# EAGLE design RTI-Dome-Shutter (EAGLE 7.7.0)
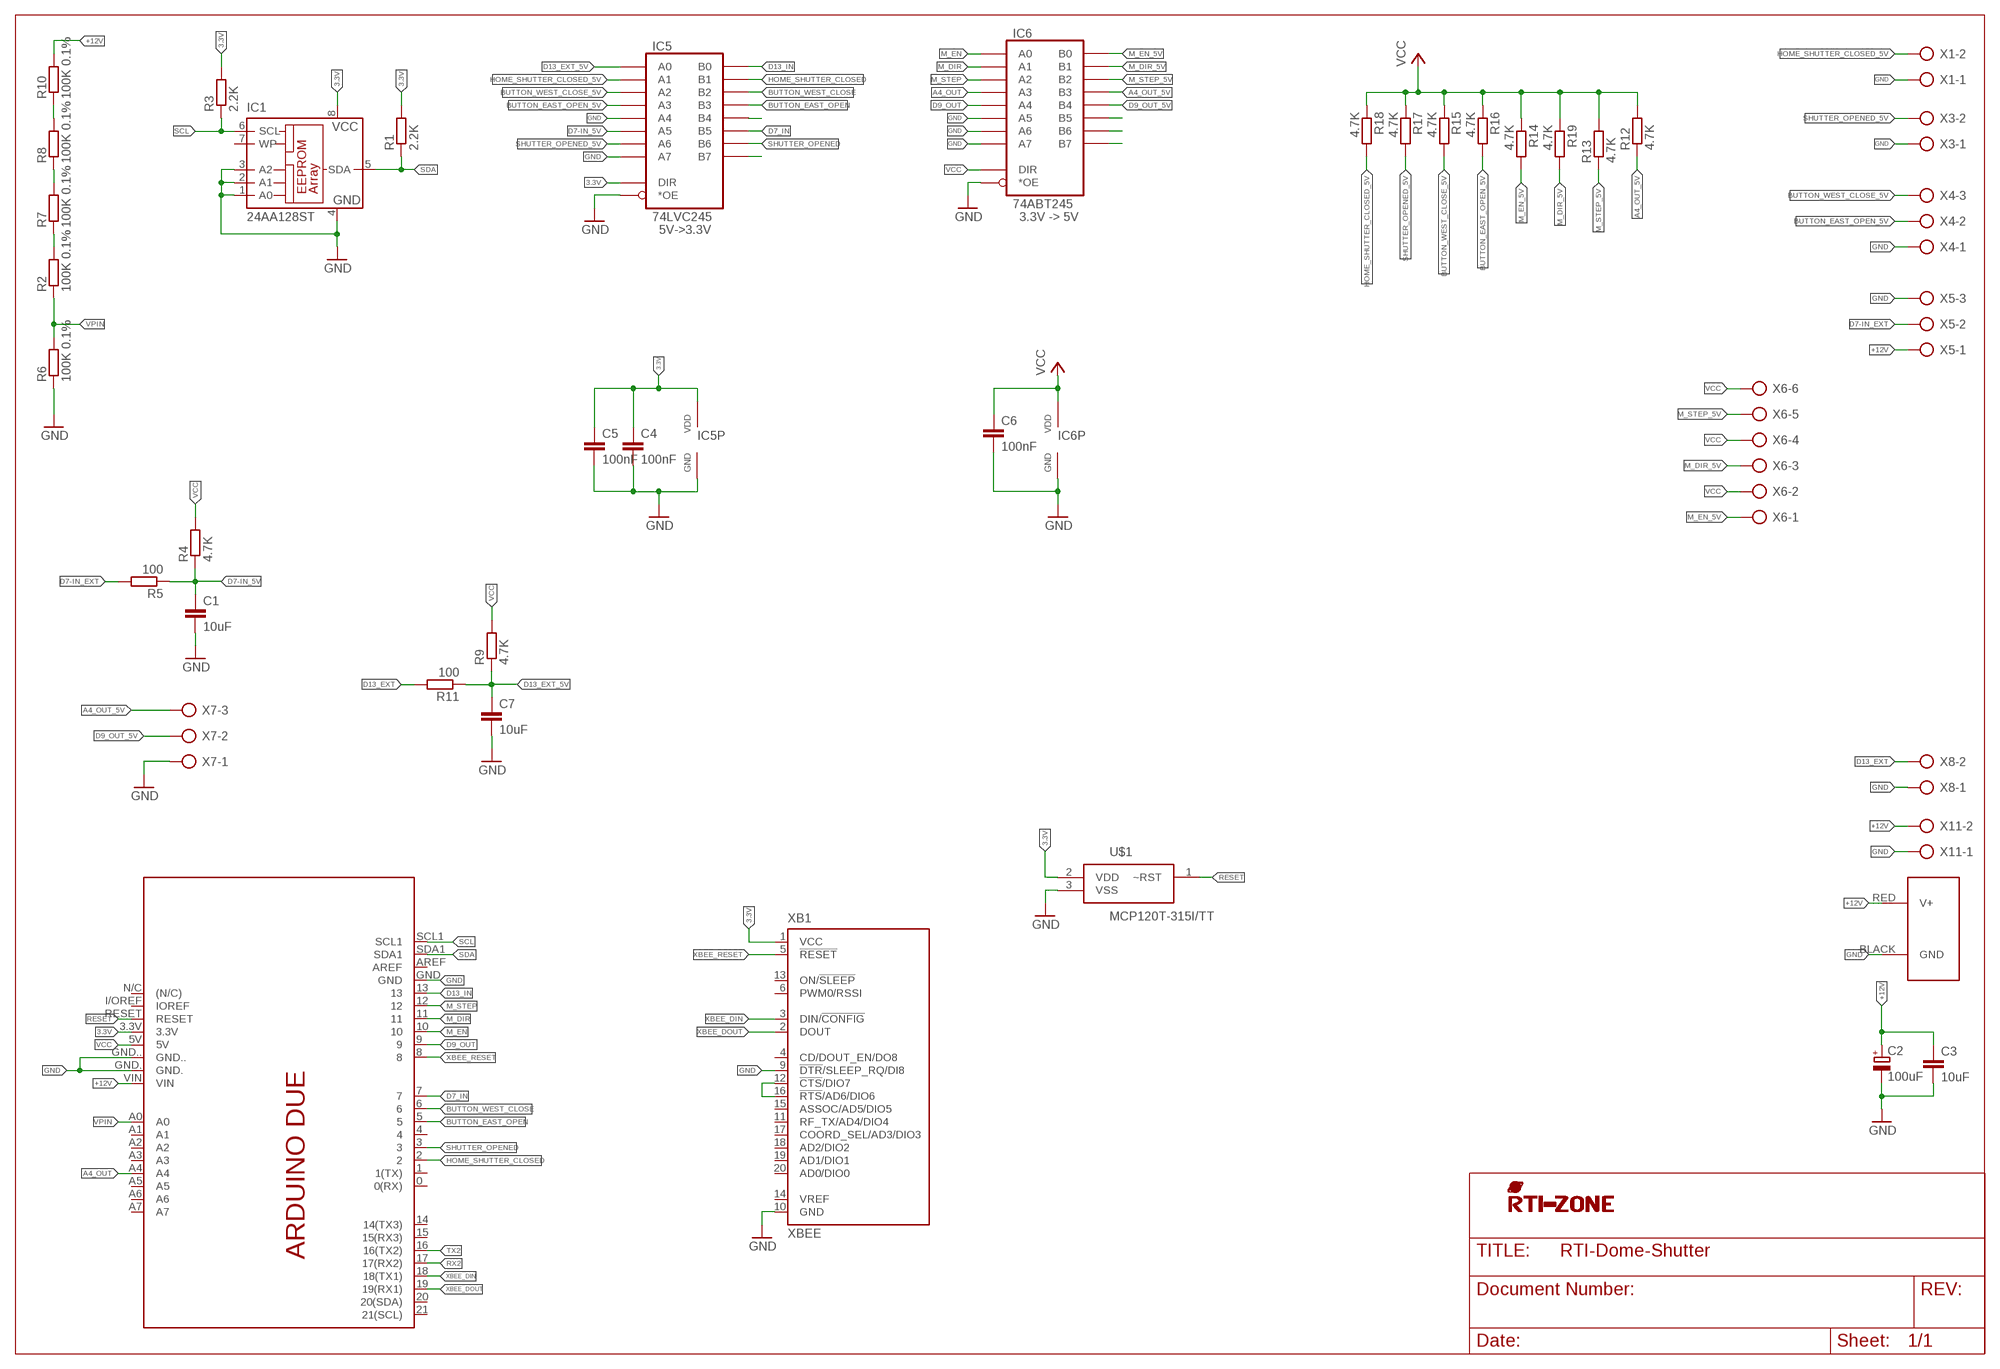
[diagram p0: schematic, sheet 1]

## Parts
C1  10uF  C-EU'0805'  [C0805]
C2  100uF  CPOL-EU  [UD-10X10_NICHICON]
C3  10uF  C-EU'0805'  [C0805]
C4  100nF  C-EU'0805'  [C0805]
C5  100nF  C-EU'0805'  [C0805]
C6  100nF  C-EU'0805'  [C0805]
C7  10uF  C-EU'0805'  [C0805]
IC1  24AA128ST  [TSSOP8]
IC5  74LVC245  [TSSOP20]
IC6  74ABT245  [TSSOP20]
J1  POWERPOLE_POWER45A  [POWERPOLE_PAIR_45A]
PCB1  ARDUINO_DUE_SHIELD_SHORT  [ARDUINO_DUE_SHIELD_SHORT]
R1  2.2K  R-EU'0805'  [R0805]
R2  100K 0.1%  R-EU'0805'  [R0805]
R3  2.2K  R-EU'0805'  [R0805]
R4  4.7K  R-EU'0805'  [R0805]
R5  100  R-EU'0805'  [R0805]
R6  100K 0.1%  R-EU'0805'  [R0805]
R7  100K 0.1%  R-EU'0805'  [R0805]
R8  100K 0.1%  R-EU'0805'  [R0805]
R9  4.7K  R-EU'0805'  [R0805]
R10  100K 0.1%  R-EU'0805'  [R0805]
R11  100  R-EU'0805'  [R0805]
R12  4.7K  R-EU'0805'  [R0805]
R13  4.7K  R-EU'0805'  [R0805]
R14  4.7K  R-EU'0805'  [R0805]
R15  4.7K  R-EU'0805'  [R0805]
R16  4.7K  R-EU'0805'  [R0805]
R17  4.7K  R-EU'0805'  [R0805]
R18  4.7K  R-EU'0805'  [R0805]
R19  4.7K  R-EU'0805'  [R0805]
U$1  MCP120T-315I/TT  MCP120T  [SOT95P237X112-3N]
U$4  RTI-LOGO_BIG  [LOGO_BIG]
X1  AK500/2  [AK500/2]
X3  AK500/2  [AK500/2]
X4  AK500/3  [AK500/3]
X5  AK500/3  [AK500/3]
X6  AK500/6  [AK500/6]
X7  AK500/3  [AK500/3]
X8  AK500/2  [AK500/2]
X11  AK500/2  [AK500/2]
XB1  XBEE  [XBEE]

## Nets
3.3V: C4.1 C5.1 IC1.8(VCC) IC5.P$1(DIR) IC5.P$20(VDD) PCB1.3.3V R1.2 R3.2 U$1.2(VDD) XB1.1(VCC)
+12V [+12V]: C2.+ C3.1 J1.RED(V+) PCB1.VIN R10.2 X5.1 X11.2
A4_OUT: IC6.P$5(A3) PCB1.A4
A4_OUT_5V: IC6.P$15(B3) R12.1 X7.3
BUTTON_EAST_OPEN: IC5.P$15(B3) PCB1.5
BUTTON_EAST_OPEN_5V: IC5.P$5(A3) R16.2 X4.2
BUTTON_WEST_CLOSE: IC5.P$16(B2) PCB1.6
BUTTON_WEST_CLOSE_5V: IC5.P$4(A2) R15.2 X4.3
D7-IN_5V: C1.1 IC5.P$7(A5) R4.1 R5.1
D7-IN_EXT: R5.2 X5.2
D7_IN: IC5.P$13(B5) PCB1.7
D9_OUT: IC6.P$6(A4) PCB1.9
D9_OUT_5V: IC6.P$14(B4) X7.2
D13_EXT: R11.2 X8.2
D13_EXT_5V: C7.1 IC5.P$2(A0) R9.1 R11.1
D13_IN: IC5.P$18(B0) PCB1.13
GND [GND]: C1.2 C2.- C3.2 C4.2 C5.2 C6.2 C7.2 IC1.1(A0) IC1.2(A1) IC1.3(A2) IC1.4(GND) IC5.P$6(A4) IC5.P$9(A7) IC5.P$10(GND) IC5.P$19(*OE) IC6.P$7(A5) IC6.P$8(A6) IC6.P$9(A7) IC6.P$10(GND) IC6.P$19(*OE) J1.BLACK(GND) PCB1.GND PCB1.GND. PCB1.GND.. R6.1 U$1.3(VSS) X1.1 X3.1 X4.1 X5.3 X7.1 X8.1 X11.1 XB1.9(!DTR!/SLEEP_RQ/DI8) XB1.10(GND)
HOME_SHUTTER_CLOSED: IC5.P$17(B1) PCB1.2
HOME_SHUTTER_CLOSED_5V: IC5.P$3(A1) R18.2 X1.2
M_DIR: IC6.P$3(A1) PCB1.11
M_DIR_5V: IC6.P$17(B1) R19.2 X6.3
M_EN: IC6.P$2(A0) PCB1.10
M_EN_5V: IC6.P$18(B0) R14.2 X6.1
M_STEP: IC6.P$4(A2) PCB1.12
M_STEP_5V: IC6.P$16(B2) R13.1 X6.5
N$1: IC5.P$11(B7)
N$2: R7.2 R8.1
N$3: R8.2 R10.1
N$4: IC5.P$14(B4)
N$5: R2.2 R7.1
N$6: IC6.P$13(B5)
N$7: IC6.P$12(B6)
N$8: IC6.P$11(B7)
N$9: XB1.12(!CTS!/DIO7) XB1.16(!RTS!/AD6/DIO6)
RESET: PCB1.RESET U$1.1(~RST)
RX2: PCB1.17(17(RX2))
SCL: IC1.6(SCL) PCB1.SCL1 R3.1
SDA: IC1.5(SDA) PCB1.SDA1 R1.1
SHUTTER_OPENED: IC5.P$12(B6) PCB1.3
SHUTTER_OPENED_5V: IC5.P$8(A6) R17.2 X3.2
TX2: PCB1.16(16(TX2))
VCC: C6.1 IC6.P$1(DIR) IC6.P$20(VDD) PCB1.5V R4.2 R9.2 R12.2 R13.2 R14.1 R15.1 R16.1 R17.1 R18.1 R19.1 X6.2 X6.4 X6.6
VPIN: PCB1.A0 R2.1 R6.2
XBEE_DIN: PCB1.18(18(TX1)) XB1.3(DIN/!CONFIG)
XBEE_DOUT: PCB1.19(19(RX1)) XB1.2(DOUT)
XBEE_RESET: PCB1.8 XB1.5(!RESET)
Unconnected: IC1.7(WP) PCB1.0(0(RX)) PCB1.1(1(TX)) PCB1.4 PCB1.14(14(TX3)) PCB1.15(15(RX3)) PCB1.20(20(SDA)) PCB1.21(21(SCL)) PCB1.A1 PCB1.A2 PCB1.A3 PCB1.A5 PCB1.A6 PCB1.A7 PCB1.AREF PCB1.I/OREF(IOREF) PCB1.N/C((N/C)) XB1.4(CD/DOUT_EN/DO8) XB1.6(PWM0/RSSI) XB1.11(RF_TX/AD4/DIO4) XB1.13(ON/!SLEEP) XB1.14(VREF) XB1.15(ASSOC/AD5/DIO5) XB1.17(COORD_SEL/AD3/DIO3) XB1.18(AD2/DIO2) XB1.19(AD1/DIO1) XB1.20(AD0/DIO0)

## Notes on the sheet
- 3.3V -> 5V
- 5V->3.3V

## Library data of the parts
C1 C3-C7 = rti:C-EU
C2 = rti:CPOL-EU
IC1 = microchip:24*: Serial EEPROM I2C; MF: MICROCHIP; MPN: 24AA128-I/ST; OC_FARNELL: unknown; OC_NEWARK: 92C6843
IC5 IC6 = rti:74*245
J1 = powerpoles:POWERPOLE_POWER: Anderson Powerpole Power Connector using ameteur radio standard layout
PCB1 = arduino_shield:ARDUINO_DUE_SHIELD_SHORT: Device for representing an Arduino Due board with a footprint in an EAGLE design. Created by Dave Young for Element14. More EAGLE documentation at: http://www.element14.com/community/community/knode/cadsoft_eagle
R1-R19 = rti:R-EU
U$1 = MCP120T:MCP120T: Microcontroller Supervisory Circuit Source: Datasheet; DESCRIPTION: Microcontroller Supervisory Circuit; HEIGHT: mm; MANUFACTURER_NAME: Microchip; MANUFACTURER_PART_NUMBER: MCP120T-315I/TT; MOUSER_PART_NUMBER: 579-MCP120T-315I/TT; MOUSER_PRICE-STOCK: https://www.mouser.com/ProductDetail/Microchip-Technology/MCP120T-315I-TT/?qs=6pREnGtJ7gEI3DoW5cf%2FYQ%3D%3D; MPN: MCP120T-315I/TT
U$4 = rti:RTI-LOGO
X1 X3 X8 X11 = con-ptr500:AK500/2: CONNECTOR; OC_FARNELL: unknown; OC_NEWARK: unknown
X4 X5 X7 = con-ptr500:AK500/3: CONNECTOR; OC_FARNELL: unknown; OC_NEWARK: unknown
X6 = con-ptr500:AK500/6: CONNECTOR; OC_FARNELL: unknown; OC_NEWARK: unknown
XB1 = maxstream:XBEE: XBee (TM) /XBee-PRO(TM) OEM RF Modules Source: MaxStream, Inc. xbee_productmanual.pdf; MPN: XBP24-Z7UIT-004; OC_FARNELL: 1751799; OC_NEWARK: 34R5507

## Net classes
0 default: width 0.254 mm, drill 0.3 mm, clearance 0.203 mm
1 +12V: width 0.254 mm, drill 0.3 mm, clearance 0.203 mm
2 GND: width 0.254 mm, drill 0.3 mm, clearance 0.203 mm

## Board
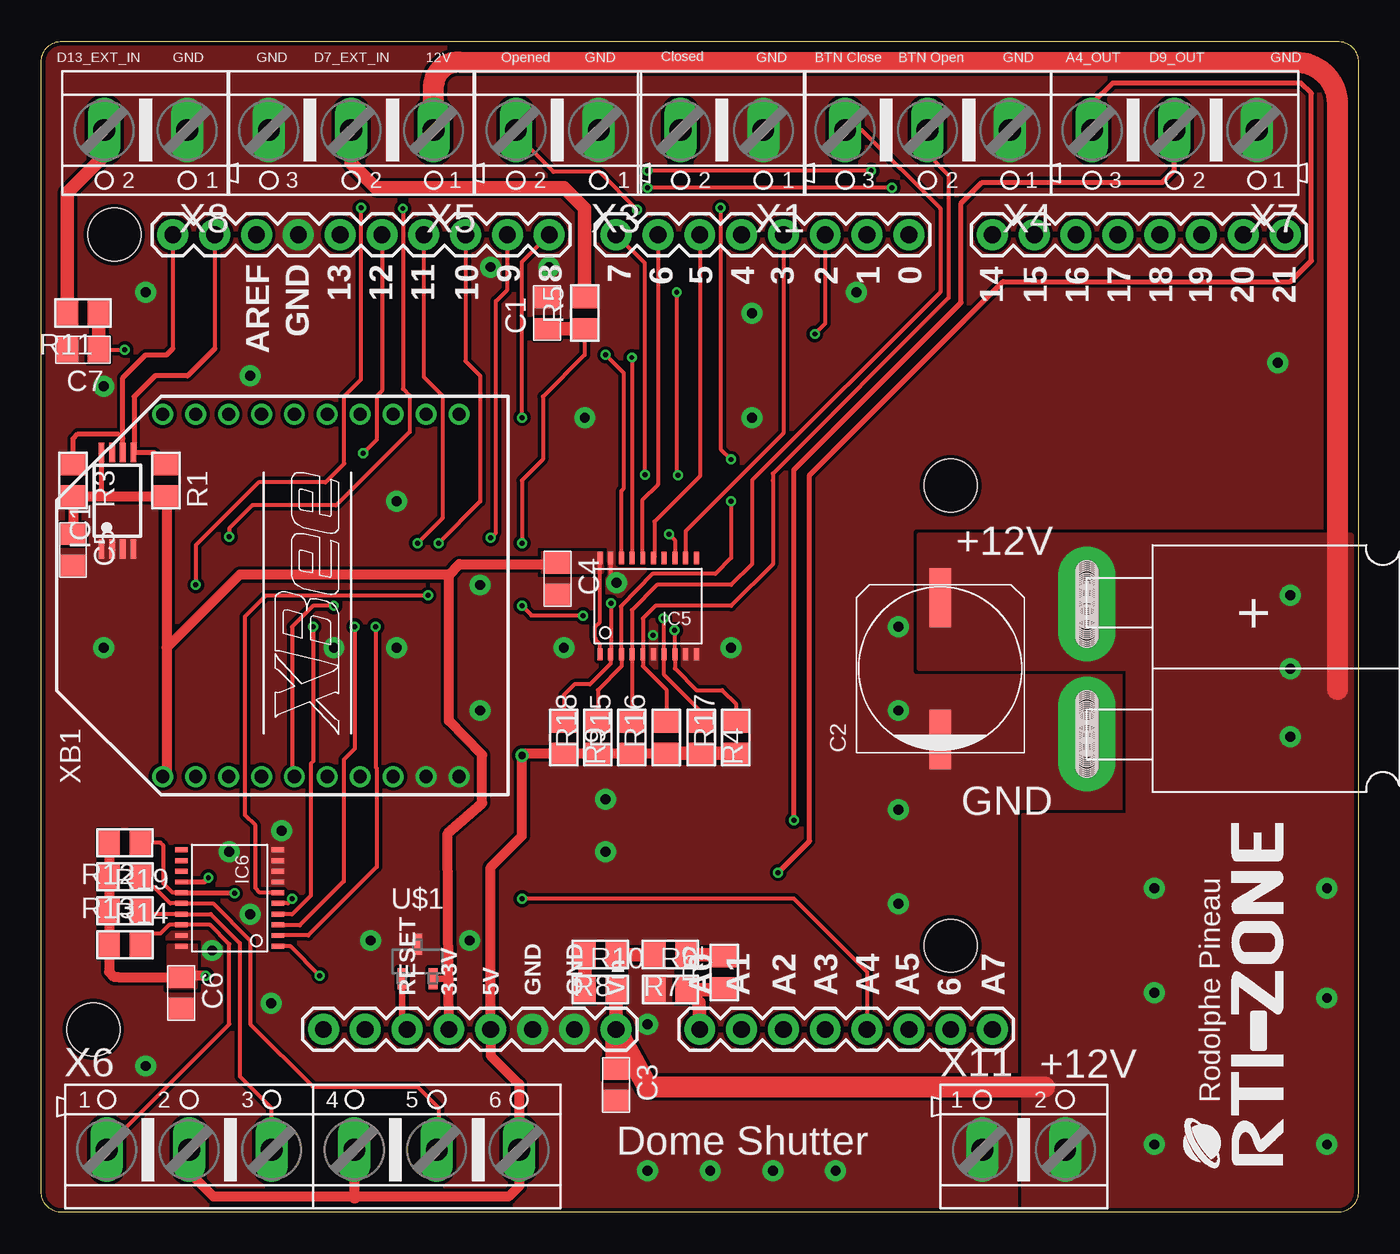
[diagram p1: board, top side]
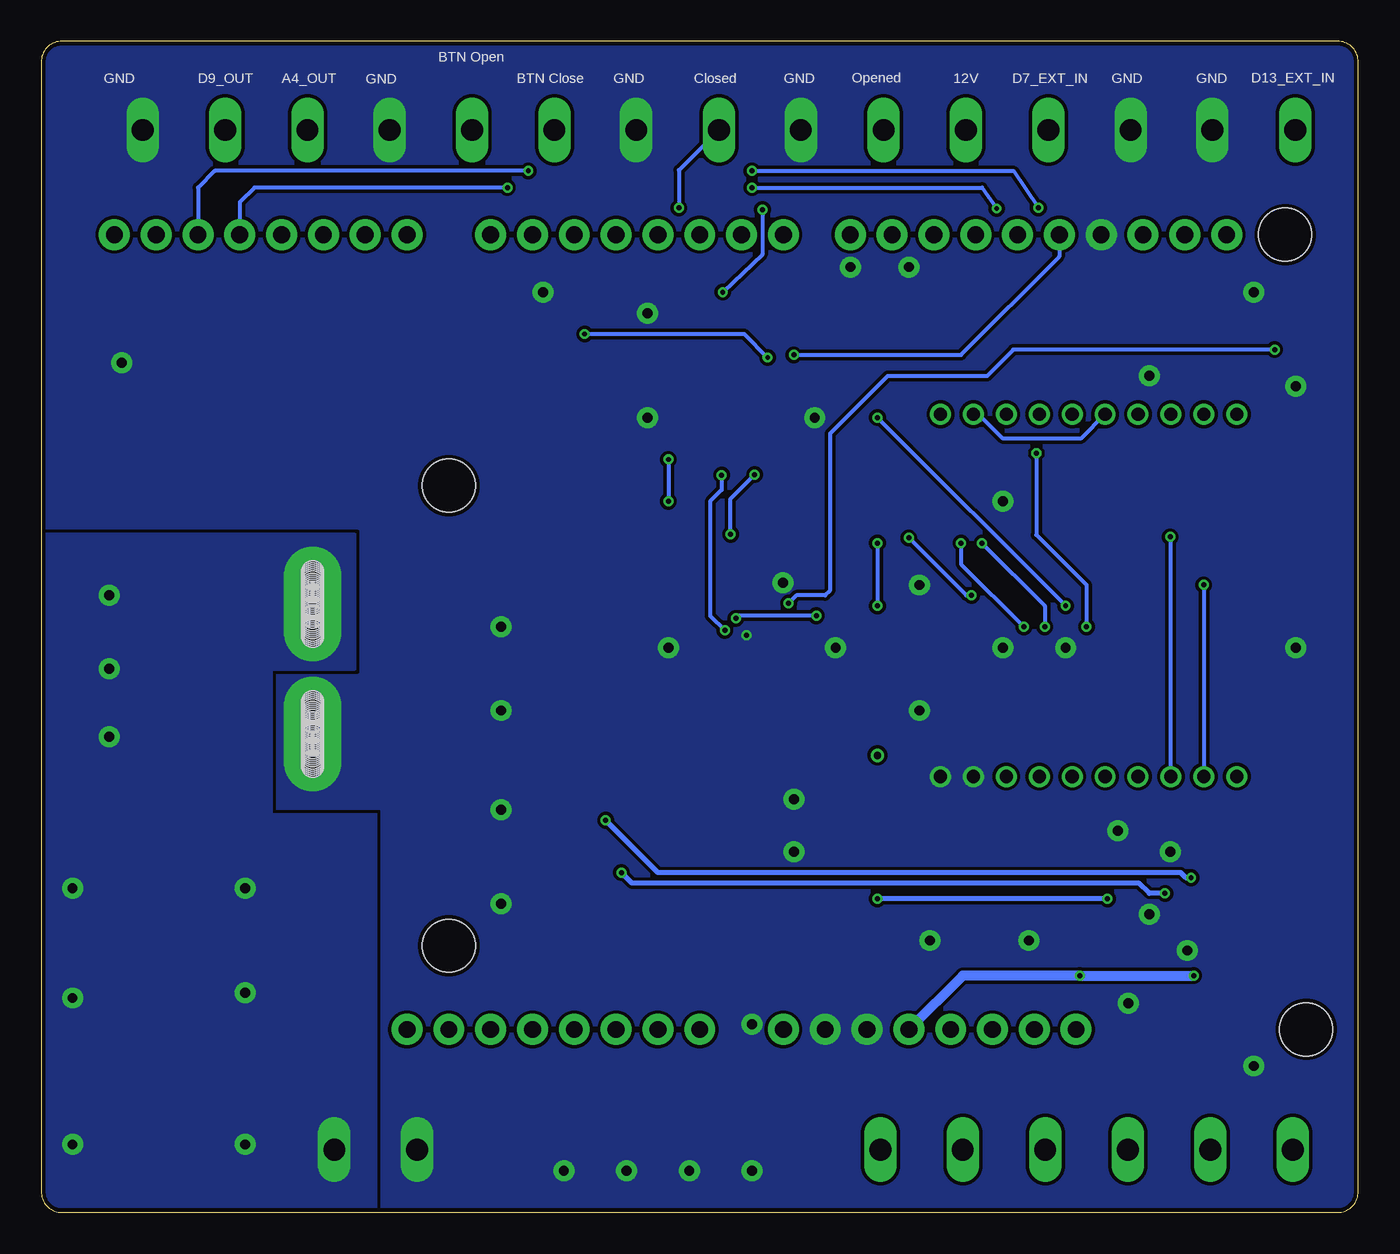
[diagram p2: board, bottom side, seen from below]

Size 80.01 x 71.12 mm. Coordinates in mm from the lower left corner, seen from the top.
Outline: 0,1.27 0,69.85 arc-90 1.27,71.12 78.74,71.12 arc-90 80.01,69.85 80.01,1.27 arc-90 78.74,0 1.27,0 arc-90 0,1.27
Copper layers (1*16): Top 0.35mm / dielectric 1.6mm / Bottom 0.35mm
Design rules "jlcpcb2layer": minimum track width 5mil, minimum drill 0.2mm, track to track 5mil, track to pad 5mil, pad to pad 5mil, via to via 5mil, smd to smd 5mil, copper to edge 10mil, drill to drill 0.5mm, minimum pad ring 6mil, minimum via ring 6mil, stop-mask expansion 0.05mm, vias tented up to drill 130mil, thermal gap 8mil

### Footprints (pad centres in the part's own frame; a part is rotated, then mirrored left to right if it is on the bottom)
C0805 = smd 1.3 x 1.5: 1 -0.95,0; 2 0.95,0
UD-10X10_NICHICON = smd 3.6 x 1.3: + 4.3,0; - -4.3,0
TSSOP8 = smd 0.35 x 1.2: 1 -0.975,-2.925; 2 -0.325,-2.925; 3 0.325,-2.925; 4 0.975,-2.925; 5 0.975,2.925; 6 0.325,2.925; 7 -0.325,2.925; 8 -0.975,2.925
TSSOP20 = smd 0.75 x 0.3: P$1 -2.94,2.885; P$2 -2.94,2.235; P$3 -2.94,1.585; P$4 -2.94,0.935; P$5 -2.94,0.285; P$6 -2.94,-0.365; P$7 -2.94,-1.015; P$8 -2.94,-1.665; P$9 -2.94,-2.315; P$10 -2.94,-2.965; P$11 2.91,-2.965; P$12 2.91,-2.315; P$13 2.91,-1.665; P$14 2.91,-1.015; P$15 2.91,-0.365; P$16 2.91,0.285; P$17 2.91,0.935; P$18 2.91,1.585; P$19 2.91,2.235; P$20 2.91,2.885
POWERPOLE_PAIR_45A = drill 1.27 pad 3.5 long: BLACK 3.97,0.02; RED -3.93,0.02 | hole 1.27: -1.95,0.02; -5.91,0.02; 1.99,0.02; 5.95,0.02; -4.64,0.02; -3.37,0.02; 3.26,0.02; 4.68,0.02; -5.656,0.02; -5.783,0.02; -5.529,0.02; -5.402,0.02; -5.275,0.02; -5.148,0.02; -5.021,0.02; -4.894,0.02; -4.767,0.02; -2.077,0.02; -2.204,0.02; -2.331,0.02; -2.458,0.02; -2.585,0.02; -2.712,0.02; -2.966,0.02; -2.839,0.02; -3.093,0.02; -3.22,0.02; -3.497,0.02; -3.624,0.02; -3.751,0.02; -3.878,0.02; -4.005,0.02; -4.132,0.02; -4.259,0.02; -4.386,0.02; -4.513,0.02; 5.823,0.02; 5.696,0.02; 5.569,0.02; 5.442,0.02; 5.315,0.02; 5.188,0.02; 5.061,0.02; 4.934,0.02; 4.807,0.02; 4.553,0.02; 4.426,0.02; 4.299,0.02; 4.045,0.02; 4.045,0.02; 4.172,0.02; 3.918,0.02; 3.791,0.02; 3.791,0.02; 3.664,0.02; 3.664,0.02; 3.664,0.02; 3.537,0.02; 3.537,0.02; 3.41,0.02; 3.133,0.02; 3.006,0.02; 2.879,0.02; 2.752,0.02; 2.625,0.02; 2.498,0.02; 2.371,0.02; 2.244,0.02; 2.117,0.02
ARDUINO_DUE_SHIELD_SHORT = drill 1.016 pad 1.88: 0 12.7,26.67; 1 10.16,26.67; 2 7.62,26.67; 3 5.08,26.67; 3.3V -15.24,-21.59; 4 2.54,26.67; 5 0,26.67; 5V -12.7,-21.59; 6 -2.54,26.67; 7 -5.08,26.67; 8 -9.144,26.67; 9 -11.684,26.67; 10 -14.224,26.67; 11 -16.764,26.67; 12 -19.304,26.67; 13 -21.844,26.67; 14 17.78,26.67; 15 20.32,26.67; 16 22.86,26.67; 17 25.4,26.67; 18 27.94,26.67; 19 30.48,26.67; 20 33.02,26.67; 21 35.56,26.67; A0 0,-21.59; A1 2.54,-21.59; A2 5.08,-21.59; A3 7.62,-21.59; A4 10.16,-21.59; A5 12.7,-21.59; A6 15.24,-21.59; A7 17.78,-21.59; AREF -26.924,26.67; GND -24.384,26.67; GND. -7.62,-21.59; GND.. -10.16,-21.59; I/OREF -20.32,-21.59; N/C -22.86,-21.59; RESET -17.78,-21.59; SCL1 -32.004,26.67; SDA1 -29.464,26.67; VIN -5.08,-21.59 | hole 3.2: -35.56,26.67; -36.83,-21.59; 15.24,11.43; 15.24,-16.51
R0805 = smd 1.3 x 1.5: 1 -0.95,0; 2 0.95,0
SOT95P237X112-3N = smd 0.559 x 1.27: 1 -0.94,-1.041; 2 0.94,-1.041; 3 0,1.041
AK500/2 = drill 1.321 long: 1 -2.515,0; 2 2.515,0
AK500/3 = drill 1.321 long: 1 -5.004,0; 2 0,0; 3 5.004,0
AK500/6 = drill 1.321 long: 1 -12.522,0; 2 -7.518,0; 3 -2.515,0; 4 2.515,0; 5 7.518,0; 6 12.522,0
XBEE = drill 0.8 pad 1.27: 1 -11,9; 2 -11,7; 3 -11,5; 4 -11,3; 5 -11,1; 6 -11,-1; 7 -11,-3; 8 -11,-5; 9 -11,-7; 10 -11,-9; 11 11,-9; 12 11,-7; 13 11,-5; 14 11,-3; 15 11,-1; 16 11,1; 17 11,3; 18 11,5; 19 11,7; 20 11,9

### Placement (x,y rotation side)
C1  30.73,54.61 90 top
C2  54.61,33.02 90 top
C3  34.92,7.75 270 top
C4  31.37,38.48 270 top
C5  1.94,40.23 270 top
C6  8.51,13.34 270 top
C7  2.54,52.39 180 top
IC1  4.64,43.21 0 top
IC5  36.83,36.83 90 top
IC6  11.43,19.05 180 top
J1  63.5,33.02 270 top
PCB1  40.01,32.7 0 top
R1  7.59,44.45 270 top
R2  41.5,14.57 90 top
R3  1.94,44.45 270 top
R4  40.1,28.83 270 top
R5  33.02,54.61 90 top
R6  38.23,13.53 0 top
R7  38.23,15.65 180 top
R8  33.97,15.65 180 top
R9  31.75,28.83 270 top
R10  33.97,13.53 0 top
R11  2.54,54.61 180 top
R12  5.08,22.45 180 top
R13  5.08,20.38 180 top
R14  5.08,16.26 0 top
R15  35.88,28.83 90 top
R16  37.97,28.83 90 top
R17  42.2,28.83 90 top
R18  33.81,28.83 90 top
R19  5.08,18.32 0 top
U$1  22.86,15.24 0 top
U$4  75.44,2.86 90 top
X1  41.35,65.72 180 top
X3  31.35,65.72 180 top
X4  53.84,65.72 180 top
X5  18.83,65.72 180 top
X6  16.51,3.81 0 top
X7  68.84,65.72 180 top
X8  6.35,65.72 180 top
X11  59.69,3.81 0 top
XB1  16.38,37.47 90 top

### Tracks (layer width: path | path; a pad name or v marks a point on that pad's centre or on a via)
3.3V
  Top 0.254: IC5.P$1 33.94,34.51 33.69,34.77 33.69,34.86 33.66,34.89 33.66,35.56 33.95,35.85 IC5.P$20
  Top 0.305: IC1.8 3.66,43.65 3.81,43.5
  Top 0.406: 31.43,39.49 C4.1 | U$1.2 24.52,14.2 24.75,13.97
  Top 0.61: 24.77,38.73 25.4,39.37 31.31,39.37 | 24.77,38.73 12.06,38.73 7.62,34.29 | 7.62,34.29 7.62,26.7 XB1.1 | PCB1.3.3V 24.75,13.97 24.7,23.02 26.8,24.86 26.8,27.78 24.77,29.84 24.77,38.73 | 7.62,34.29 7.62,43.47 arc90 R1.2 3.81,43.5 R3.2 C5.1
  Top 0.813: 31.31,39.37 C4.1
  pour Top (isolate 0.254, no thermals): 30.48,40.07 34.07,40.07 34.07,38.86 30.48,38.86
+12V  (via drill 0.6 pad 1.27)
  Top 0.813: R10.2 PCB1.VIN
  Top 1.27: 78.74,31.75 78.74,67.31 arc90 76.2,69.85 25.4,69.85 arc90 23.83,68.41 X5.1 | 60.96,7.62 36.83,7.62 PCB1.VIN C3.1
  Top 2.54: 63.52,37.32 J1.RED
  other vias: 75.88,37.47 75.88,33.02 75.88,28.89 78.11,19.68 78.11,13.02 78.11,4.13 67.63,19.68 67.63,13.34 67.63,4.13
  pour Top (no thermals): 53.34,41.15 79.57,41.15 79.88,0 59.69,0 59.69,24.13 66.04,24.13 66.04,33.02 53.34,33.02
  pour Bottom (no thermals): 60.96,41.15 79.88,41.15 79.88,0 59.69,0 59.69,24.13 66.04,24.13 66.04,33.02 60.96,33.02
A4_OUT  (via drill 0.3 pad 0.25)
  Top 0.254: v29.21,19.05 45.72,19.05 50.16,14.61 PCB1.A4 | v15.24,19.05 15.24,19.02 14.99,18.76 IC6.P$5
  Bottom 0.305: v15.24,19.05 v29.21,19.05
A4_OUT_5V  (via drill 0.3)
  Top 0.254: IC6.P$15 7.99,19.41 7.43,19.97 7.43,22.26 7.24,22.45 R12.1
  Top 0.305: IC6.P$15 11.7,19.41 v11.75,19.37 | v44.77,20.64 46.67,22.54 46.67,44.77 58.42,56.52 75.88,56.52 77.15,57.78 77.15,67.94 76.52,68.58 65.09,68.58 63.82,67.31 63.82,66.67 63.84,66.66 X7.3
  Bottom 0.305: v11.75,19.37 12.7,19.37 13.34,20 44.13,20 v44.77,20.64
BUTTON_EAST_OPEN
  Top 0.254: PCB1.5 40.01,44.7 37.24,41.94 37.24,39.79 IC5.P$15
BUTTON_EAST_OPEN_5V
  Top 0.254: R16.2 37.97,31.75 36.55,33.18 IC5.P$5 36.54,36.07 37.31,36.83 41.91,36.83 44.45,39.37 44.45,44.45 44.45,44.86 55.12,55.53 55.12,62.99 53.84,64.27 X4.2
BUTTON_WEST_CLOSE
  Top 0.254: PCB1.6 37.47,44.2 36.51,43.24 36.51,39.77 IC5.P$16
BUTTON_WEST_CLOSE_5V
  Top 0.254: R15.2 35.9,29.8 IC5.P$4 35.88,33.91 35.88,36.58 37.4,38.1 41.91,38.1 43.18,39.37 43.18,44.45 54.61,55.88 54.61,60.96 49.85,65.72 X4.3
D7-IN_5V  (via drill 0.3 pad 0.25)
  Top 0.254: R4.1 40.1,30.39 37.84,32.64 IC5.P$7 37.81,33.92 v37.81,36.07 | R5.1 33.02,52.07 30.48,49.53 30.48,45.72 29.21,44.45 v29.21,40.64 | v29.21,36.83 29.78,36.26 32.89,36.26 v32.92,36.23
  Top 0.813: C1.1 R5.1
  Bottom 0.254: v29.21,40.64 v29.21,36.83 | v32.92,36.23 37.66,36.23 v37.81,36.07
D7-IN_EXT
  Top 0.813: R5.2 33.02,60.96 31.75,62.23 20.32,62.23 18.83,63.72 X5.2
D7_IN  (via drill 0.3 pad 0.25)
  Top 0.254: v36.67,44.8 36.67,57.63 PCB1.7 | v38.13,41.18 38.49,40.82 IC5.P$13
  Bottom 0.254: v38.13,41.18 38.13,43.34 v36.67,44.8
D9_OUT  (via drill 0.3)
  Top 0.254: IC6.P$6 13.29,19.41 13.02,19.68 13.02,23.5 12.38,24.13 12.38,36.2 13.65,37.47 v23.5,37.47 | v27.3,40.96 27.62,41.27 27.62,42.55 27.62,55.34 28.32,56.04 PCB1.9
  Bottom 0.254: v23.5,37.47 23.81,37.47 v27.3,40.96
D9_OUT_5V  (via drill 0.3)
  Top 0.305: v45.72,23.81 45.72,45.09 55.88,55.24 55.88,61.28 57.15,62.55 68.1,62.55 68.83,63.28 X7.2 | IC6.P$14 9.9,20.07 v10.16,20.32
  Bottom 0.305: v10.16,20.32 10.48,20.32 10.79,20.64 42.55,20.64 v45.72,23.81
D13_EXT
  Top 0.813: X8.2 3.83,64.16 1.59,61.91 R11.2
D13_EXT_5V  (via drill 0.3)
  Top 0.254: R9.1 31.75,31.43 32.38,32.07 33.34,32.07 34.59,33.33 IC5.P$2 34.61,33.9 v34.61,36.99 | C7.1 3.81,52.38 v5.08,52.39
  Top 0.813: R11.1 C7.1
  Bottom 0.254: v5.08,52.39 20.95,52.39 22.54,50.8 28.57,50.8 32.07,47.31 32.07,37.78 32.38,37.47 34.13,37.47 v34.61,36.99
D13_IN  (via drill 0.3 pad 0.25)
  Top 0.254: v34.29,52.07 35.4,50.96 35.4,43.97 35.24,43.82 IC5.P$18
  Bottom 0.254: PCB1.13 18.16,58.04 24.13,52.07 v34.29,52.07
GND  (via drill 0.3 pad 0.25, 0.6 pad 1.27)
  Top 0.254: IC5.P$19 34.59,38.59 v34.96,38.23
  other vias: 41.91,34.29 26.67,38.1 43.18,48.26 34.29,25.08 26.67,30.48 33.02,48.26 30.86,57.4 27.3,57.4 21.59,43.18 17.78,34.29 75.12,51.59 12.7,50.8 11.43,21.91 52.07,24.45 52.07,18.73 34.29,21.91 52.07,30.48 43.18,54.61 52.07,35.56 49.53,55.88 21.59,34.29 3.81,34.29 31.75,34.29 14.61,23.18 13.97,12.7 26.04,16.51 6.35,8.89 10.38,15.91 36.83,2.54 40.64,2.54 44.45,2.54 48.26,2.54 3.81,50.16 6.35,55.88 36.83,11.43 37.18,35.05 20,16.51 12.7,18.1
  pour Bottom (rank 2, no thermals): 0,0 0,71.12 80.01,71.12 80.01,0
  pour Top (rank 2, no thermals): 0,0 0,71.12 80.01,71.12 80.01,0
HOME_SHUTTER_CLOSED  (via drill 0.3 pad 0.25)
  Top 0.254: PCB1.2 47.62,53.98 v46.99,53.34 | 35.88,39.76 IC5.P$17 35.88,39.76 | v35.88,51.91 35.88,39.76
  Bottom 0.254: v46.99,53.34 37.31,53.34 v35.88,51.91
HOME_SHUTTER_CLOSED_5V  (via drill 0.3 pad 0.25)
  Top 0.254: R18.2 33.81,31.72 35.24,33.15 IC5.P$3 35.21,33.92 35.21,36.8 37.15,38.77 40.96,38.77 41.91,39.75 v41.91,43.18 | v41.27,60.99 41.27,46.35 v41.91,45.72
  Bottom 0.254: v41.91,45.72 v41.91,43.18 | X1.2 41.27,63.28 v41.27,60.99
M_DIR  (via drill 0.3 pad 0.25)
  Top 0.254: PCB1.11 23.24,50.74 24.38,49.59 24.38,42.16 v22.86,40.64 | v19.05,35.56 19.05,28.16 18.38,27.5 18.38,20.1 15.72,17.43 14.4,17.43 IC6.P$3
  Bottom 0.254: v22.86,40.64 19.05,36.83 v19.05,35.56
M_DIR_5V
  Top 0.254: R19.2 6.24,18.11 IC6.P$17 10.3,18.11 12.06,16.35 12.06,8.26 13.97,6.35 13.97,3.83 X6.3
M_EN  (via drill 0.3 pad 0.25)
  Top 0.254: PCB1.10 25.78,51.69 26.67,50.8 26.67,43.18 v24.13,40.64 | v20.32,35.56 20.32,27.02 20.38,26.96 20.38,20.99 16.22,16.83 14.38,16.83 IC6.P$2
  Bottom 0.254: v24.13,40.64 24.13,39.37 v20.32,35.56
M_EN_5V
  Top 0.254: R14.2 6.7,16.92 7.24,16.92 7.78,17.46 IC6.P$18 10.26,17.46 11.43,16.29 11.43,11.43 3.99,3.99 X6.1
M_STEP  (via drill 0.3 pad 0.25)
  Top 0.254: PCB1.12 20.7,49.88 20.38,49.56 20.38,46.93 v19.56,46.1 | v16.51,35.56 16.51,27.37 16.38,27.24 16.38,19.24 15.24,18.1 14.39,18.1 IC6.P$4
  Bottom 0.254: v19.56,46.1 19.56,41.15 16.51,38.1 v16.51,35.56
M_STEP_5V
  Top 0.254: R13.1 6.67,19.75 6.86,19.75 7.84,18.77 IC6.P$16 10.45,18.77 12.7,16.51 12.7,11.43 16.51,7.62 22.86,7.62 24.13,6.35 24.13,3.91 X6.5
N$2
  Top 0.813: R8.1 R7.2
N$3
  Top 0.813: R8.2 R10.1
N$5
  Top 0.813: R7.1 41.37,15.65 R2.2
N$9
  Bottom 0.254: XB1.16 16.86,46.99 21.59,46.99 23.07,48.47 XB1.12
RESET
  Top 0.406: U$1.1 21.92,11.42 PCB1.RESET
SCL
  Top 0.254: PCB1.SCL1 8,52.45
  Top 0.305: IC1.6 4.96,46.99 | 4.96,46.99 4.96,50.68 6.35,52.07 7.62,52.07 8,52.45 | R3.1 1.94,46.99 2.22,47.28 4.67,47.28 4.96,46.99
SDA
  Top 0.254: PCB1.SDA1 10.54,52.45
  Top 0.305: 10.54,52.45 8.89,50.8 6.92,50.8 5.65,49.53 5.65,46.18 IC1.5 6.85,46.14 R1.1
SHUTTER_OPENED
  Top 0.254: PCB1.3 45.09,47.31 39.15,41.37 IC5.P$12
SHUTTER_OPENED_5V  (via drill 0.3 pad 0.25)
  Top 0.254: R17.2 42.2,30.89 41.37,31.72 39.81,31.72 38.49,33.04 IC5.P$8 38.48,33.9 v38.48,35.34 | v38.61,55.88 38.61,44.83 v38.67,44.77 | v36.2,60.9 33.91,63.18 31.11,63.18 28.84,65.46 X3.2
  Bottom 0.254: v36.2,60.9 36.2,58.17 v38.61,55.88 | v38.67,44.77 38.67,43.88 39.37,43.18 39.37,36.23 v38.48,35.34
VCC  (via drill 0.3, 0.3 pad 0.25, 0.45 pad 0.81)
  Top 0.254: v16.92,14.38 15.14,16.16 IC6.P$1
  Top 0.61: C6.1 | C6.1 4.67,14.29 4.45,14.29 4.13,14.6 R14.1 R19.1 R13.2 R12.2 | v10,14.38 8.61,14.38 C6.1 | 8.89,3.71 8.89,2.54 10.48,0.95 19.05,0.95 28.38,0.95 29.03,1.6 X6.6 29.03,7.8 27.3,9.53 PCB1.5V 27.3,20.95 29.21,22.86 v29.21,27.75 29.4,27.88 R9.2 R18.1 R15.1 R16.1 | X6.4 19.02,0.98
  Top 0.813: 8.89,3.71 X6.2 | 19.02,0.98 19.05,0.95 | C6.1 | R16.1 R4.2 R17.1
  Bottom 0.61: v10,14.38 v16.92,14.38 24.04,14.38 PCB1.5V
  pour Top (no thermals): 7.75,16.22 9.4,16.22 9.4,13.65 7.75,13.65
VPIN
  Top 0.813: PCB1.A0 39.97,12.73 R6.2 41.4,13.53 R2.1
XBEE_DIN  (via drill 0.3)
  Top 0.254: v51.69,62.23 v36.83,62.23 | v11.43,41.02 11.43,41.53 12.83,42.93 17.91,42.93 22.38,47.4 22.38,49.59 21.97,50.01 v21.97,60.96
  Bottom 0.254: v36.83,62.23 22.86,62.23 v21.97,60.96 | v11.43,41.02 11.43,26.51 | v51.69,62.23 67.06,62.23 67.94,61.34 PCB1.18
  Bottom 0.305: 11.43,26.51 XB1.3
XBEE_DOUT  (via drill 0.3)
  Top 0.254: v50.42,63.25 v36.83,63.25 | v9.4,38.1 9.4,40.51 13.21,44.32 17.27,44.32 18.41,45.47 18.41,49.56 19.43,50.58 v19.43,60.99
  Bottom 0.254: v36.83,63.25 20.95,63.25 v19.43,60.99 | v9.4,38.1 9.4,26.48 XB1.2 | v50.42,63.25 69.47,63.25 70.48,62.23 PCB1.19
XBEE_RESET  (via drill 0.3)
  Top 0.254: v17.78,36.83 16.51,36.83 15.24,35.56 15.24,26.61 XB1.5 | v29.21,48.26 29.21,57.72 PCB1.8
  Bottom 0.254: v29.21,48.26 v17.78,36.83

### Text on the board
tPlace: D13_EXT_IN | GND | GND | D7_EXT_IN | 12V | Opened | GND | Closed | GND | BTN Close | BTN Open | GND | A4_OUT | D9_OUT | GND | +12V | GND | +12V
bPlace: BTN Open | D13_EXT_IN | GND | GND | D7_EXT_IN | 12V | Opened | GND | Closed | GND | BTN Close | GND | A4_OUT | D9_OUT | GND
tNames: Dome Shutter